# Altium schematic sheet microcontroller_reset_button.schdoc
size A4
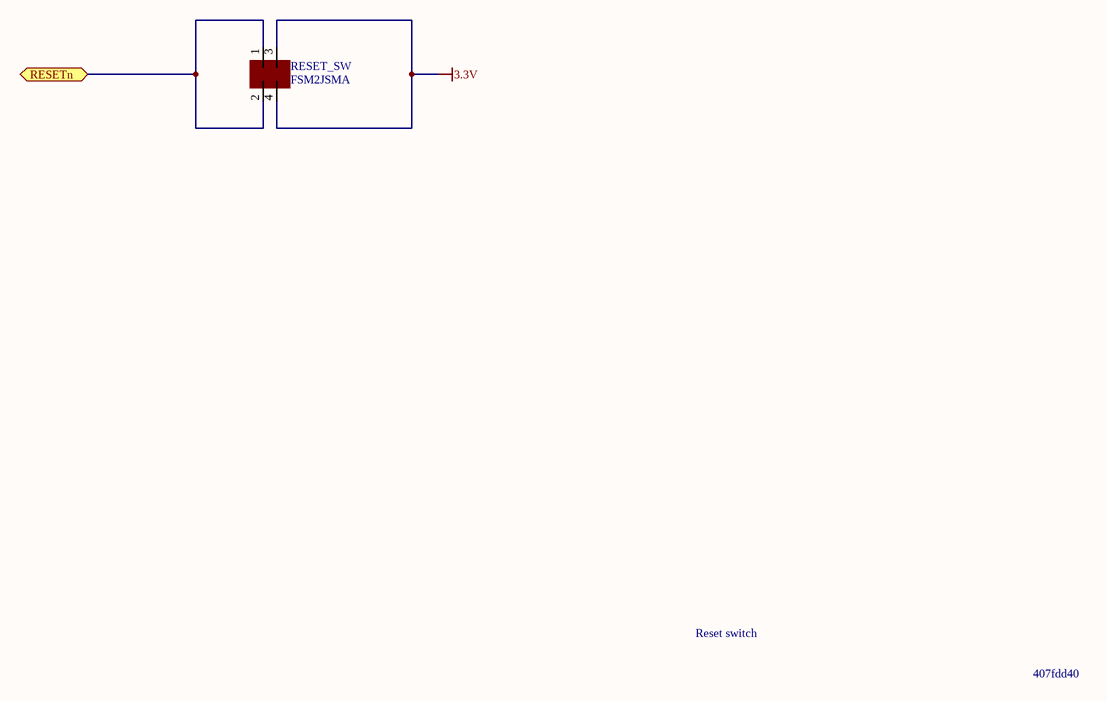
[diagram p0: microcontroller_reset_button.schdoc]

## Parts
RESET_SW  FSM2JSMA  [Button]

## Ports
RESETn

## Nets
3.3V: RESET_SW.3 RESET_SW.4
RESETn: RESET_SW.1 RESET_SW.2 ; port RESETn

## Notes on the sheet
- Reset switch
- 407fdd40

## Library data of the parts
RESET_SW = switch-button